# Altium schematic sheet Mircod_TEST_LIST_1.SchDoc
size A4
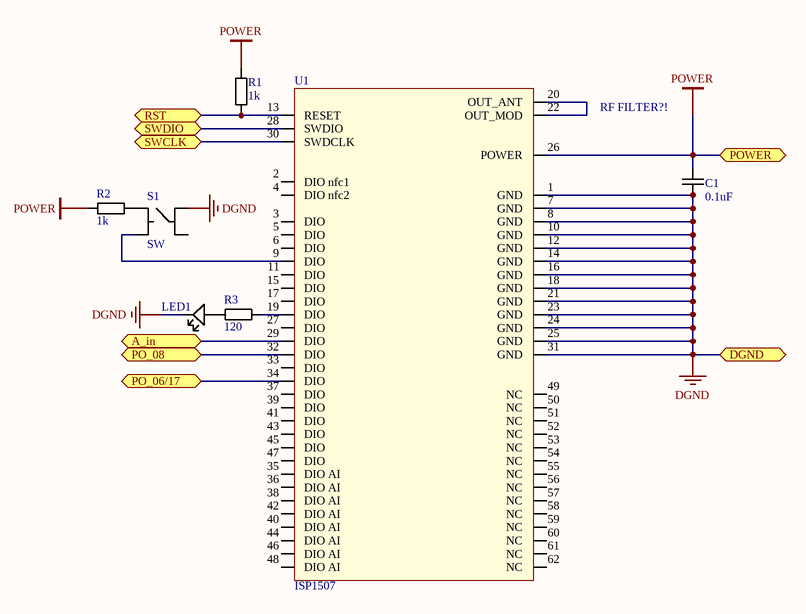
[diagram p0: Mircod_TEST_LIST_1.SchDoc]

## Parts
C1  0.1uF  [Csmd_0402]
LED1  LED  [RDSMD_0603]  (value not drawn)
R1  1k  [SMD_0402]
R2  1k  [SMD_0402]
R3  120  [SMD_0402]
S1  SW  [6x6 Tact Switch]
U1  ISP1507  [LGA62 ISP1507]

## Ports
A_in, DGND, PO_06/17, PO_08, POWER, RST, SWCLK, SWDIO

## Nets
DGND: C1.1 LED1.2 S1.4 U1.1(GND) U1.7(GND) U1.8(GND) U1.10(GND) U1.12(GND) U1.14(GND) U1.16(GND) U1.18(GND) U1.21(GND) U1.23(GND) U1.24(GND) U1.25(GND) U1.31(GND) ; port DGND
POWER: C1.2 R1.2 R2.2 U1.26(POWER) ; port POWER
A_in: U1.29(DIO) ; port A_in
PO_06/17: U1.34(DIO) ; port PO_06/17
PO_08: U1.32(DIO) ; port PO_08
RST: R1.1 U1.13(RESET) ; port RST
SWCLK: U1.30(SWDCLK) ; port SWCLK
SWDIO: U1.28(SWDIO) ; port SWDIO
NetLED1_1: LED1.1 R3.1
NetR2_1: R2.1 S1.1
NetR3_2: R3.2 U1.19(DIO)
NetS1_2: S1.2 U1.9(DIO)
NetU1_20: U1.20(OUT_ANT) U1.22(OUT_MOD)

Not connected (* = marked no-connect by the designer): S1 3; U1 2(DIO_nfc1) 3(DIO) 4(DIO_nfc2) 5(DIO) 6(DIO) 11(DIO) 15(DIO) 17(DIO) 27(DIO) 33(DIO) 35(DIO_AI) 36(DIO_AI) 37(DIO) 38(DIO_AI) 39(DIO) 40(DIO_AI) 41(DIO) 42(DIO_AI) 43(DIO) 44(DIO_AI) 45(DIO) 46(DIO_AI) 47(DIO) 48(DIO_AI) 49(NC) 50(NC) 51(NC) 52(NC) 53(NC) 54(NC) 55(NC) 56(NC) 57(NC) 58(NC) 59(NC) 60(NC) 61(NC) 62(NC)

## Notes on the sheet
- RF FILTER?!

## Library data of the parts
C1 = C_SMD: CAPACITOR
R1-R3 = R_SMD: RESISTOR
S1 = Switch: KLS7-TS6604 6x6 Tact Switch Series
U1 = ISP1507: High Performance Bluetooth 5 Ready, NFC*  & ANT Low Energy Module with MCU & Antenna